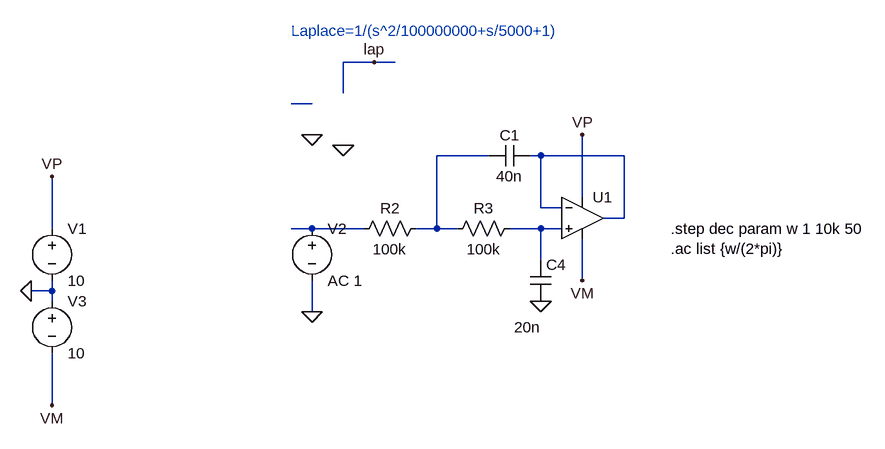
[diagram p0: schematic wave_in_out.asc]
wave_in_out.asc, the LTspice schematic file:
Version 4
SHEET 1 880 680
WIRE -208 -80 -256 -80
WIRE -176 -80 -208 -80
WIRE -256 -32 -256 -80
WIRE -304 -16 -336 -16
WIRE -32 64 -112 64
WIRE 48 64 32 64
WIRE 176 64 48 64
WIRE 112 128 112 32
WIRE 48 144 48 64
WIRE 80 144 48 144
WIRE 176 160 176 64
WIRE 176 160 144 160
WIRE -704 176 -704 96
WIRE -304 176 -336 176
WIRE -224 176 -304 176
WIRE -112 176 -112 64
WIRE -112 176 -144 176
WIRE -80 176 -112 176
WIRE 48 176 0 176
WIRE 80 176 48 176
WIRE 48 224 48 176
WIRE 112 256 112 192
WIRE -704 272 -704 256
WIRE -704 272 -736 272
WIRE -704 288 -704 272
WIRE -304 304 -304 256
WIRE -704 448 -704 368
FLAG -304 304 0
FLAG -736 272 0
FLAG 48 288 0
FLAG -704 96 VP
FLAG -704 448 VM
FLAG 112 32 VP
FLAG 112 256 VM
FLAG -256 48 0
FLAG -304 32 0
FLAG -208 -80 lap
SYMBOL Opamps\\UniversalOpamp2 112 160 R0
SYMATTR InstName U1
SYMATTR SpiceModel level.1
SYMBOL voltage -704 160 R0
WINDOW 123 0 0 Left 0
WINDOW 39 0 0 Left 0
SYMATTR InstName V1
SYMATTR Value 10
SYMBOL voltage -304 160 R0
WINDOW 123 0 0 Left 0
WINDOW 39 0 0 Left 0
SYMATTR InstName V2
SYMATTR Value AC 1
SYMBOL voltage -704 272 R0
WINDOW 123 0 0 Left 0
WINDOW 39 0 0 Left 0
SYMATTR InstName V3
SYMATTR Value 10
SYMBOL res -128 160 R90
WINDOW 0 0 56 VBottom 0
WINDOW 3 32 56 VTop 0
SYMATTR InstName R2
SYMATTR Value 100k
SYMBOL res 16 160 R90
WINDOW 0 0 56 VBottom 0
WINDOW 3 32 56 VTop 0
SYMATTR InstName R3
SYMATTR Value 100k
SYMBOL cap 32 224 R0
WINDOW 3 -25 104 Left 0
SYMATTR Value 20n
SYMATTR InstName C4
SYMBOL cap 32 48 R90
WINDOW 0 0 32 VBottom 0
WINDOW 3 32 32 VTop 0
SYMATTR InstName C1
SYMATTR Value 40n
TEXT 248 176 Left 0 !.step dec param w 1 10k 50\n.ac list {w/(2*pi)}
TEXT -336 -128 Left 0 ;Laplace=1/(s^2/100000000+s/5000+1)

The netlist it stands for:
* wave_in_out.asc
XU1 N005 N003 VP VM N003 level.1 Avol=1Meg GBW=10Meg Slew=10Meg ilimit=25m rail=0 Vos=0 phimargin=45 en=0 enk=0 in=0 ink=0 Rin=500Meg  ; pins IN+ IN- V+ V- OUT
V1 VP 0 10
V2 N004 0 AC 1
V3 0 VM 10
R2 N002 N004 100k
R3 N005 N002 100k
C4 N005 0 20n
C1 N003 N002 40n
.step dec param w 1 10k 50
.ac list {w/(2*pi)}
* Laplace=1/(s^2/100000000+s/5000+1)
.lib UniversalOpamps2.sub
.backanno
.end